# EAGLE design its2 (EAGLE 7.7.0)
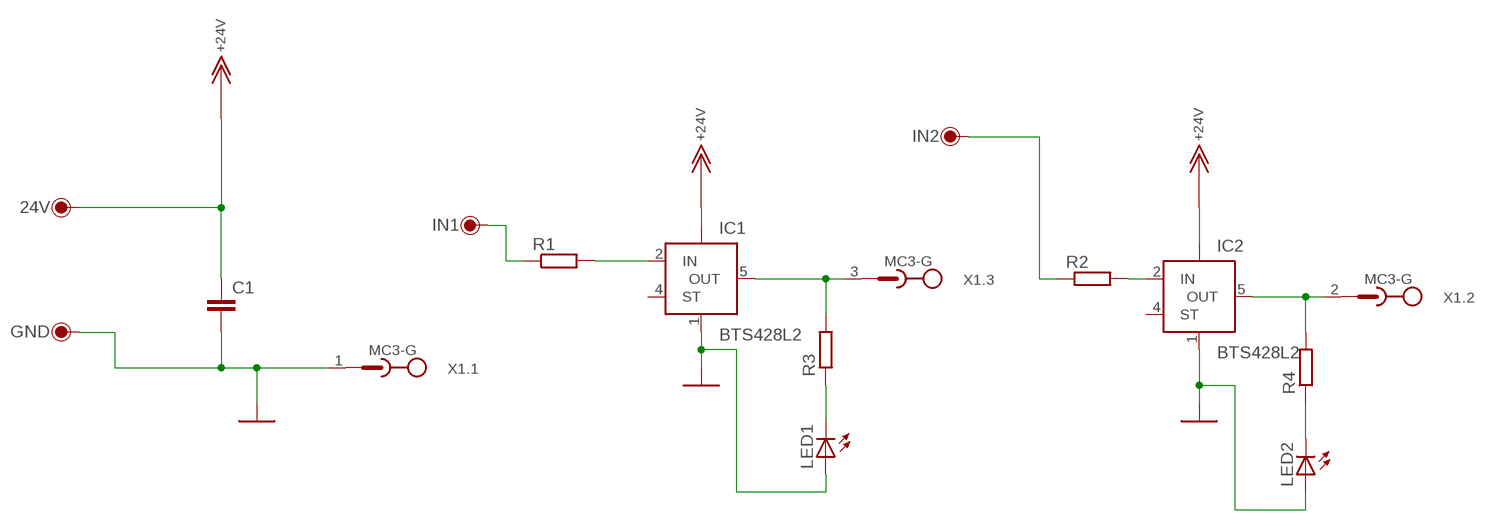
[diagram p0: schematic, sheet 1]

## Parts
24V  PINGERAD  [PINGERAD]
C1  C-EUC0805K  [C0805K]
GND  PINGERAD  [PINGERAD]
IC1  BTS428L2  [TO252-5-11]
IC2  BTS428L2  [TO252-5-11]
IN1  PINGERAD  [PINGERAD]
IN2  PINGERAD  [PINGERAD]
LED1  LEDSML1206  [SML1206]
LED2  LEDSML1206  [SML1206]
R1  R-EU_M0805  [M0805]
R2  R-EU_M0805  [M0805]
R3  R-EU_R0805  [R0805]
R4  R-EU_R0805  [R0805]
X1  MC3-G  [MC3-G]

## Nets
+24V: 24V.1 C1.1 IC1.TAB(VBB) IC2.TAB(VBB)
GND: C1.2 GND.1 IC1.1(GND) IC2.1(GND) LED1.A LED2.A X1.1
N$1: IN1.1 R1.1
N$2: IC2.5(OUT) R4.2 X1.2
N$3: IC1.5(OUT) R3.2 X1.3
N$4: IN2.1 R2.1
N$5: IC2.2(IN) R2.2
N$6: IC1.2(IN) R1.2
N$8: LED1.C R3.1
N$10: LED2.C R4.1
Unconnected: IC1.4(ST) IC2.4(ST)

## Library data of the parts
24V GND IN1 IN2 = 3PASSIVE:PINGERAD
C1 = resistor:C-EU: CAPACITOR, European symbol
IC1 IC2 = infineon:BTS428L2: Smart High-Side Power Switch One Channel: 60mOhm Status Feedback Source: Source: www.infineon.com .. BTS428L2_20030912.pdf; OC_FARNELL: unknown; OC_NEWARK: unknown
LED1 LED2 = led:LED: LED OSRAM: - CHIPLED LG R971, LG N971, LY N971, LG Q971, LY Q971, LO R971, LY R971 LH N974, LH R974 LS Q976, LO Q976, LY Q976 LO Q996 - Hyper CHIPLED LW Q18S LB Q993, LB Q99A, LB R99A - SideLED LS A670, LO A670, LY A670, LG A670, LP A670 LB A673, LV A673, LT A673, LW A673 LH A674 LY A675 LS A676, LA A676, LO A676, LY A676, LW A676 LS A679, LY A679, LG A679 - Hyper Micro SIDELED® LS Y876, LA Y876, LO Y876, LY Y876 LT Y87S - SmartLED LW L88C, LW L88S LB L89C, LB L89S, LG L890 LS L89K, LO L89K, LY L89K LS L896, LA L896, LO L896, LY L896 - TOPLED LS T670, LO T670, LY T670, LG T670, LP T670 LSG T670, LSP T670, LSY T670, LOP T670, LYG T670 LG T671, LOG T671, LSG T671 LB T673, LV T673, LT T673, LW T673 LH T674 LS T676, LA T676, LO T676, LY T676, LB T676, LH T676, LSB T676, LW T676 LB T67C, LV T67C, LT T67C, LS T67K, LO T67K, LY T67K, LW E67C LS E67B, LA E67B, LO E67B, LY E67B, LB E67C, LV E67C, LT E67C LW T67C LS T679, LY T679, LG T679 LS T770, LO T770, LY T770, LG T770, LP T770 LB T773, LV T773, LT T773, LW T773 LH T774 LS E675, LA E675, LY E675, LS T675 LS T776, LA T776, LO T776, LY T776, LB T776 LHGB T686 LT T68C, LB T68C - Hyper Mini TOPLED® LB M676 - Mini TOPLED Santana® LG M470 LS M47K, LO M47K, LY M47K Source: http://www.osram.convergy.de LUXEON: - LUMILED® LXK2-PW12-R00, LXK2-PW12-S00, LXK2-PW14-U00, LXK2-PW14-V00 LXK2-PM12-R00, LXK2-PM12-S00, LXK2-PM14-U00 LXK2-PE12-Q00, LXK2-PE12-R00, LXK2-PE12-S00, LXK2-PE14-T00, LXK2-PE14-U00 LXK2-PB12-K00, LXK2-PB12-L00, LXK2-PB12-M00, LXK2-PB14-N00, LXK2-PB14-P00, LXK2-PB14-Q00 LXK2-PR12-L00, LXK2-PR12-M00, LXK2-PR14-Q00, LXK2-PR14-R00 LXK2-PD12-Q00, LXK2-PD12-R00, LXK2-PD12-S00 LXK2-PH12-R00, LXK2-PH12-S00 LXK2-PL12-P00, LXK2-PL12-Q00, LXK2-PL12-R00 Source: www.luxeon.com KINGBRIGHT: KA-3528ASYC Source: www.kingbright.com
R1-R4 = resistor:R-EU_: RESISTOR, European symbol
X1 = con-phoenix-381_l:MC3-G: Mini-Combicon 3.81mm horizontal 3-polig (mit Gegenstecker)

## Net classes
0 default: clearance 0.205 mm

## Board
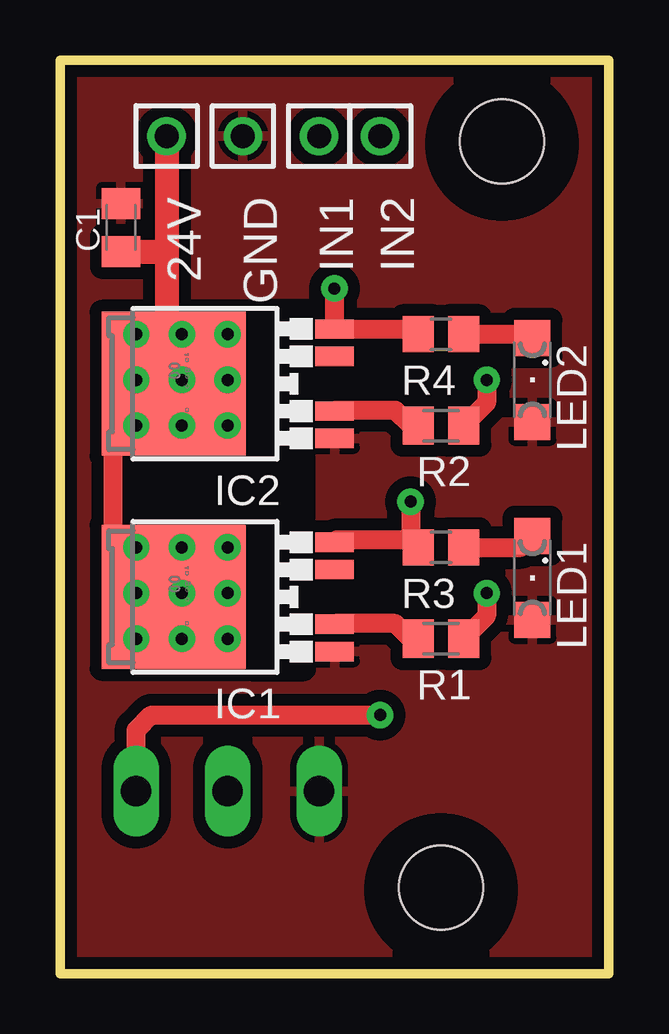
[diagram p1: board, top side]
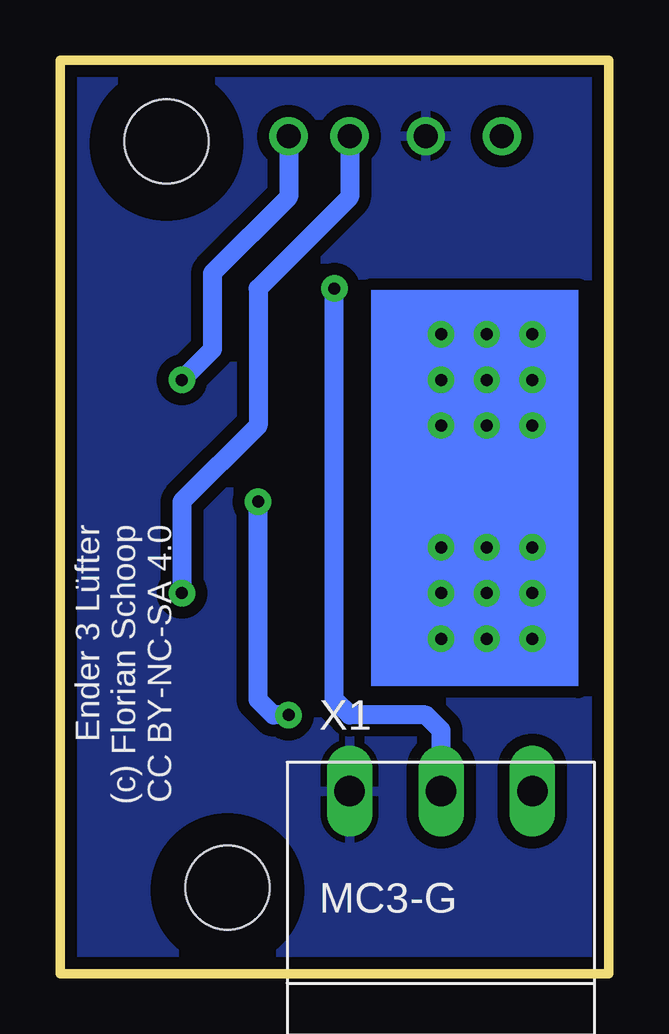
[diagram p2: board, bottom side, seen from below]

Size 22.86 x 38.1 mm. Coordinates in mm from the lower left corner, seen from the top.
Outline: 0,38.1 22.86,38.1 22.86,0 0,0 0,38.1
Copper layers (1*16): Component 0.035mm / dielectric 1.5mm / Solder 0.035mm
Design rules "its *": minimum track width 10mil, minimum drill 0.6mm, track to track 0.205mm, track to pad 0.205mm, pad to pad 0.205mm, via to via 0.205mm, smd to smd 8mil, copper to edge 0.4mm, drill to drill 8mil, minimum pad ring 10mil, minimum via ring 8mil, stop-mask expansion 4mil, vias tented up to drill 0mil, thermal gap 10mil
Holes 3.5 mm at 18.42,34.71 15.88,3.59
tRestrict: area 15.9,32.1 to 20.9,37.1; area 13.4,1 to 18.4,6; area 7.9,12.7 to 10.2,27.6
bRestrict: area 15.9,32.1 to 20.9,37.1; area 13.4,1 to 18.4,6

### Footprints (pad centres in the part's own frame; a part is rotated, then mirrored left to right if it is on the bottom)
PINGERAD = drill 1 pad 1.6: 1 0,0
C0805K = smd 1.3 x 1.6: 1 -1,0; 2 1,0
TO252-5-11 = smd 0.8 x 1.6: 1 -2.28,-5.41; 2 -1.14,-5.41; 4 1.14,-5.41; 5 2.28,-5.41 | smd 6 x 6: TAB 0,1.3
SML1206 = smd 1.5 x 1.5: A 1.75,0; C -1.75,0
M0805 = smd 1.3 x 1.6: 1 -0.95,0; 2 0.95,0
R0805 = smd 1.3 x 1.5: 1 -0.95,0; 2 0.95,0
MC3-G = drill 1.27 long: 1 -3.81,0; 2 0,0; 3 3.81,0

### Placement (x,y rotation side)
24V  4.45,34.92 270 top
C1  2.54,31.11 90 top
GND  7.62,34.92 270 top
IC1  6.03,15.72 90 top
IC2  6.03,24.61 90 top
IN1  10.79,34.92 270 top
IN2  13.34,34.92 270 top
LED1  19.68,16.51 270 top
LED2  19.68,24.77 270 top
R1  15.88,13.97 180 top
R2  15.88,22.86 180 top
R3  15.88,17.78 180 top
R4  15.88,26.67 180 top
X1  6.99,7.62 0 bottom

### Tracks (layer width: path | path; a pad name or v marks a point on that pad's centre or on a via)
+24V
  Component 0.8: IC1.TAB 5.08,16.06 5.08,17.78 4.73,18.13 2.57,18.13 2.22,18.1 2.22,24.13 4.26,24.13 IC2.TAB
  Component 1: 24V.1 4.45,29.84 | 4.45,29.84 4.45,24.89 IC2.TAB | C1.1 4.18,30.11 4.45,29.84
GND
  pour Solder (isolate 0.5): 0,38.1 22.86,38.1 22.86,0 0,0
  pour Component (isolate 0.5): 0,38.1 22.86,38.1 22.86,0 0,0
N$1  (via drill 0.5 pad 1.1)
  Component 0.8: v17.78,15.88 17.78,14.93 R1.1
  Solder 0.8: IN1.1 10.79,32.38 14.61,28.57 14.61,22.86 17.78,19.68 v17.78,15.88
N$2  (via drill 0.5 pad 1.1)
  Component 0.8: R4.2 14.71,26.89 IC2.5 v11.43,28.57
  Solder 0.8: X1.2 6.99,10.16 7.62,10.79 10.79,10.79 11.43,11.43 v11.43,28.57
N$3  (via drill 0.5 pad 1.1)
  Component 0.8: X1.3 3.18,10.16 3.81,10.79 v13.34,10.79 | v14.61,19.68 14.61,18.1 | 14.61,18.1 R3.2 | 14.61,18.1 11.55,18.1 IC1.5
  Solder 0.8: v13.34,10.79 13.97,10.79 14.61,11.43 v14.61,19.68
N$4  (via drill 0.5 pad 1.1)
  Component 0.8: v17.78,24.77 17.78,23.82 R2.1
  Solder 0.8: IN2.1 13.34,32.38 16.51,29.21 16.51,26.04 v17.78,24.77
N$5
  Component 0.8: R2.2 14.61,22.86 13.97,23.5 11.47,23.5 IC2.2
N$6
  Component 0.8: R1.2 14.61,13.97 13.97,14.61 11.47,14.61 IC1.2
N$7  (via drill 0.5 pad 1.1)
  other vias: 3.18,26.67
N$8
  Component 0.8: R3.1 19.21,17.78 LED1.C
N$9  (via drill 0.5 pad 1.1)
  other vias: 6.99,26.67
N$10
  Component 0.8: R4.1 19.53,26.67 LED2.C
N$11  (via drill 0.5 pad 1.1)
  other vias: 5.08,26.67
N$12  (via drill 0.5 pad 1.1)
  other vias: 3.18,22.86
N$13  (via drill 0.5 pad 1.1)
  other vias: 5.08,22.86
N$14  (via drill 0.5 pad 1.1)
  other vias: 6.99,22.86
N$15  (via drill 0.5 pad 1.1)
  other vias: 6.99,24.77
N$16  (via drill 0.5 pad 1.1)
  other vias: 5.08,24.77
N$17  (via drill 0.5 pad 1.1)
  other vias: 3.18,24.77
N$18  (via drill 0.5 pad 1.1)
  other vias: 3.18,17.78
N$19  (via drill 0.5 pad 1.1)
  other vias: 5.08,17.78
N$20  (via drill 0.5 pad 1.1)
  other vias: 6.99,17.78
N$21  (via drill 0.5 pad 1.1)
  other vias: 6.99,15.88
N$22  (via drill 0.5 pad 1.1)
  other vias: 6.99,13.97
N$23  (via drill 0.5 pad 1.1)
  other vias: 5.08,13.97
N$24  (via drill 0.5 pad 1.1)
  other vias: 3.18,13.97
N$25  (via drill 0.5 pad 1.1)
  other vias: 3.18,15.88
N$26  (via drill 0.5 pad 1.1)
  other vias: 5.08,15.88
(copper drawn outside any net)
  shapes: Solder area x1

### Text on the board
bNames: Ender 3 Lüfter / (c) Florian Schoop / CC BY-NC-SA 4.0